# Altium project transmitter.PrjPcb
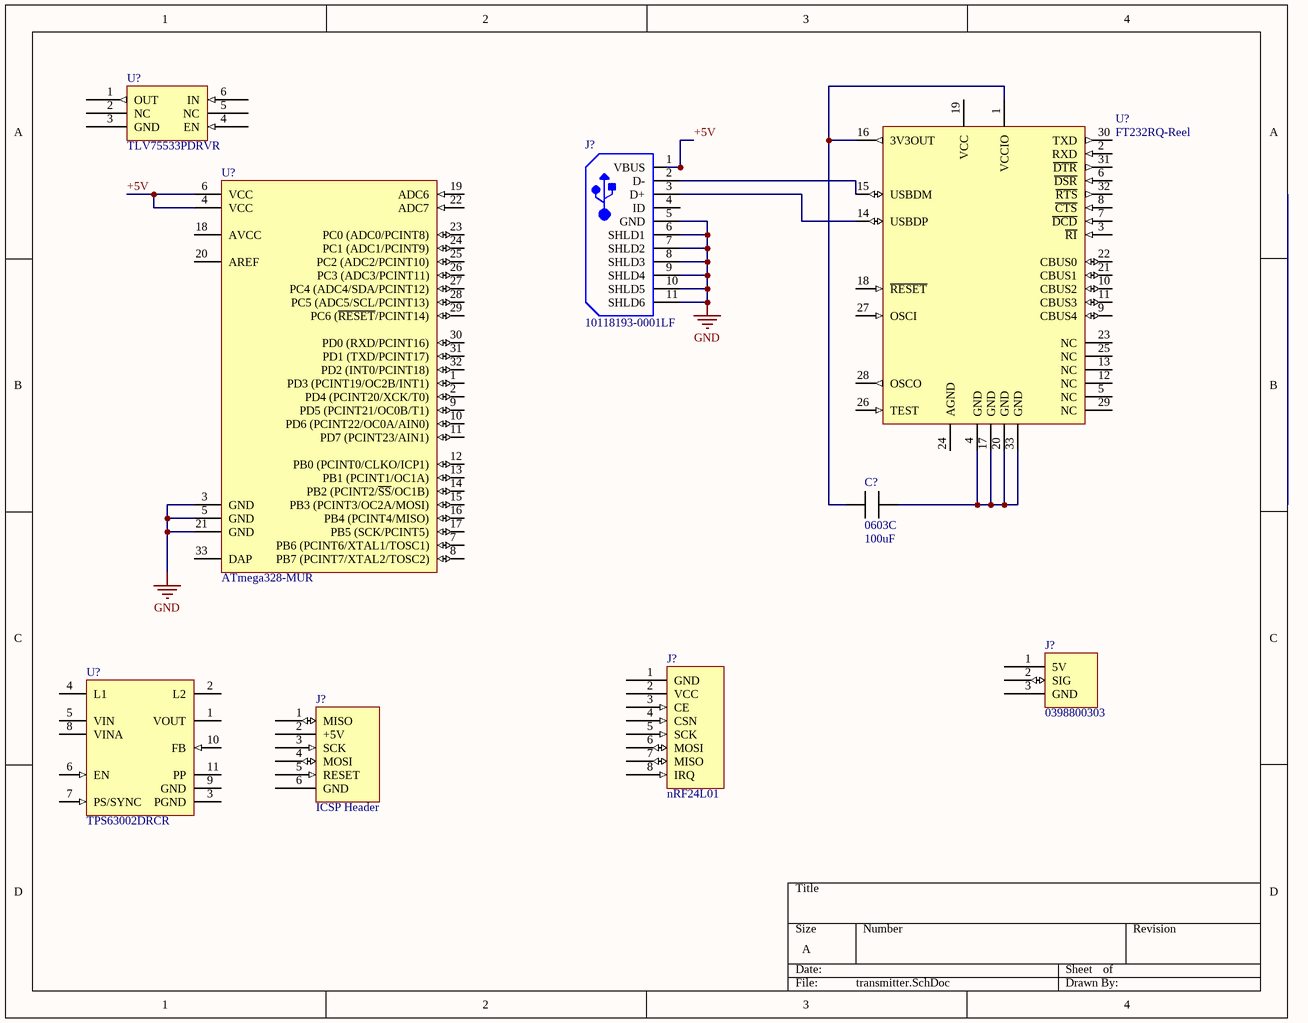
[diagram p0: transmitter.SchDoc]
1 sheet, 9 parts. Net scope: global (net labels, ports and power ports of the same name join across sheets).

## Sheet transmitter.SchDoc
size A

### Parts
(Parts that share a designator on the sheet are numbered #1, #2 ... from top to bottom, then left to right.)
C?  0603C  Capacitance: 100uF  [0603/1608 SMD Resistor]
J?#1  10118193-0001LF  [FCI-10118193-0001LF-5_V]
J?#2  0398800303  [0398800303]
J?#3  nRF24L01  [nRF24L01]
J?#4  ICSP Header
U?#1  TLV75533PDRVR  [SON65P200X80_HS-7N]
U?#2  FT232RQ-Reel  [PQFN5X5-32_V]
U?#3  ATmega328-MUR  [32M1-A_L]
U?#4  TPS63002DRCR  [DRC10-2400X1650TP]

### Nets
GND: J?#1.5(GND) J?#1.6(SHLD1) J?#1.7(SHLD2) J?#1.8(SHLD3) J?#1.9(SHLD4) J?#1.10(SHLD5) J?#1.11(SHLD6) U?#3.3(GND) U?#3.5(GND) U?#3.21(GND)
+5V: J?#1.1(VBUS) U?#3.4(VCC) U?#3.6(VCC)
NetC?_1: C?.1 U?#2.4(GND) U?#2.17(GND) U?#2.20(GND) U?#2.33(GND)
NetC?_2: C?.2 U?#2.1(VCCIO) U?#2.16(3V3OUT)
NetJ?#1_2: J?#1.2(D-) U?#2.15(USBDM)
NetJ?#1_3: J?#1.3(D+) U?#2.14(USBDP)

Not connected (* = marked no-connect by the designer): J?#1 4(ID); J?#2 1(5V) 2(SIG) 3(GND); J?#3 1(GND) 2(VCC) 3(CE) 4(CSN) 5(SCK) 6(MOSI) 7(MISO) 8(IRQ); J?#4 1(MISO) 2(+5V) 3(SCK) 4(MOSI) 5(RESET) 6(GND); U?#1 1(OUT) 2(NC) 3(GND) 4(EN) 5(NC) 6(IN); U?#2 2(RXD) 3(~{RI}) 5(NC) 6(~{DSR}) 7(~{DCD}) 8(~{CTS}) 9(CBUS4) 10(CBUS2) 11(CBUS3) 12(NC) 13(NC) 18(~{RESET}) 19(VCC) 21(CBUS1) 22(CBUS0) 23(NC) 24(AGND) 25(NC) 26(TEST) 27(OSCI) 28(OSCO) 29(NC) 30(TXD) 31(~{DTR}) 32(~{RTS}); U?#3 1(PD3_(PCINT19/OC2B/INT1)) 2(PD4_(PCINT20/XCK/T0)) 7(PB6_(PCINT6/XTAL1/TOSC1)) 8(PB7_(PCINT7/XTAL2/TOSC2)) 9(PD5_(PCINT21/OC0B/T1)) 10(PD6_(PCINT22/OC0A/AIN0)) 11(PD7_(PCINT23/AIN1)) 12(PB0_(PCINT0/CLKO/ICP1)) 13(PB1_(PCINT1/OC1A)) 14(PB2_(PCINT2/~{SS}/OC1B)) 15(PB3_(PCINT3/OC2A/MOSI)) 16(PB4_(PCINT4/MISO)) 17(PB5_(SCK/PCINT5)) 18(AVCC) 19(ADC6) 20(AREF) 22(ADC7) 23(PC0_(ADC0/PCINT8)) 24(PC1_(ADC1/PCINT9)) 25(PC2_(ADC2/PCINT10)) 26(PC3_(ADC3/PCINT11)) 27(PC4_(ADC4/SDA/PCINT12)) 28(PC5_(ADC5/SCL/PCINT13)) 29(PC6_(~{RESET}/PCINT14)) 30(PD0_(RXD/PCINT16)) 31(PD1_(TXD/PCINT17)) 32(PD2_(INT0/PCINT18)) 33(DAP); U?#4 1(VOUT) 2(L2) 3(PGND) 4(L1) 5(VIN) 6(EN) 7(PS/SYNC) 8(VINA) 9(GND) 10(FB) 11(PP)

### Library data of the parts
C? = 0603C: 0603 SMD capacitor
J?#1 = CMP-2000-05119-1: Micro USB B Type Receptacle, -55 to 85 degC, 5-Pin SMD, RoHS, Tape and Reel; Manufacturer: FCI; Insulation Resistance: 1000MOhms; Gender: Female; Current Rating: 1.8A; Number of Contacts: 5Contact; Connector Type: MicroUSBTypeBreceptacle; Mounting Angle: Right; Datasheet Version: Rev. C, 05/2015; Packaging: Reel; Product Category: USBConnectors; Standard: USB2.0; Factory Pack Quantity: 1200; Operating Temperature Range: -55Cto+85C; Termination Style: SMD/SMT; Datasheet URL: http://datasheet.octopart.com/10118193-0001LF-FCI-datasheet-55953155.pdf; Contact Material: CopperAlloy; RoHS: Details; Contact Plating: Gold; Flammability Rating: UL94V-0; Manufacturer URL: http://www.fci.com/; Brand: FCI; Product: MicroUSBTypeBConnectors; Color: Black
J?#2 = 0398800303: 3 Position Wire to Board Terminal Block Horizontal with Board 0.200" (5.08mm) Through Hole; Supplier 1: Digi-Key
J?#3 = nRF24L01: 2.4GHz wireless transceiver module
J?#4 = ICSP Header: In-circuit serial programmer, used to burn bootloader onto chips like the ATMega328P.
U?#1 = TLV75533PDRVR: 500-mA, Low IQ, Small Size, Low Dropout Regulator; Supplier 1: Digi-Key
U?#2 = CMP-0078-00009-3: USB UART Asynchronous Serial Data Transfer Chip, 32-pin QFN, Tape and Reel; Manufacturer: FTDI; ComponentLink1URL: http://www.ftdichip.com/; RevisionNote: DatasheetVersion updated to 2.10 Mar-2012; ComponentLink1Description: Manufacturer URL; PackageReference: PQFN5X5-32; PackageDescription: 32-Pin Quad Flat No-Lead 0.5 mm Pitch, Pullback, 3.2 x 3.2 mm Exposed Pad; DatasheetVersion: ver 2.10, Mar-2012; PartNumber: FT232RQ-Reel; ComponentLink2URL: http://www.ftdichip.com/Support/Documents/DataSheets/ICs/DS_FT232R.pdf; PackageVersion: Mar-12; ComponentLink2Description: Datasheet
U?#3 = CMP-0095-00073-1: 8-bit AVR Microcontroller, 32KB Flash, 1KB EEPROM, 2KB SRAM, 32-pin MLF, Industrial Grade (-40°C to 85°C); DatasheetVersion: revA, Jan-2010; Code_JEDEC: MO-220-VHHD-2; PackageDescription: 32-Pin Micro Lead Frame Package (MLF),  5 x 5 x 1.0 mm Body, Pitch 0.50 mm, 3.10mm Exposed Pad; PackageReference: 32M1-A; PackageVersion: revE, May-2006
U?#4 = CMP-0345-00004-1: Buck-Boost Voltage Converter with 1.8 to 5.5 V Input and 5 V Output, -40 to 85 degC, 10-Pin SON (DRC), Green (RoHS & no Sb/Br); Manufacturer: Texas Instruments; Iq(Typ)(mA): 0.03; Preset Vout(V): 5; Regulated Outputs(#): 1; Iout(Max)(A): 1.2; Dynamic Voltage Scaling: TRUE; Vin(Min)(V): 1.8; Switching Frequency(Max)(kHz): 1500; SubFamily: Buck-Boost Regulator; Vin(Max)(V): 5.5; DatasheetVersion: SLVS520B; ComponentLink1Description: Datasheet; ComponentLink1URL: http://www.ti.com/general/docs/lit/getliterature.tsp?genericPartNumber=TPS63002&fileType=pdf; Vout(Max)(V): 5; PackageVersion: revL, Sep-2011; PackageDescription: 10-Pin Plastic Small Outline No-Lead, 3 x 3 x 1 mm Body, 0.5 mm Pitch, Exposed Pad; ComponentLink2URL: http://www.ti.com/litv/pdf/mpds117k; Topology: Buck-Boost; Vout(Min)(V): 5; Mounting Technology: Surface Mount; ComponentLink2Description: Package Specification; PackageReference: DRC10-2400X1650TP; Eco-Plan: Green (RoHS & no Sb/Br); PartNumber: TPS63002DRCR; Synchronous Rectification: TRUE